# EAGLE schematic Relay Board A (EAGLE 8.1.0)
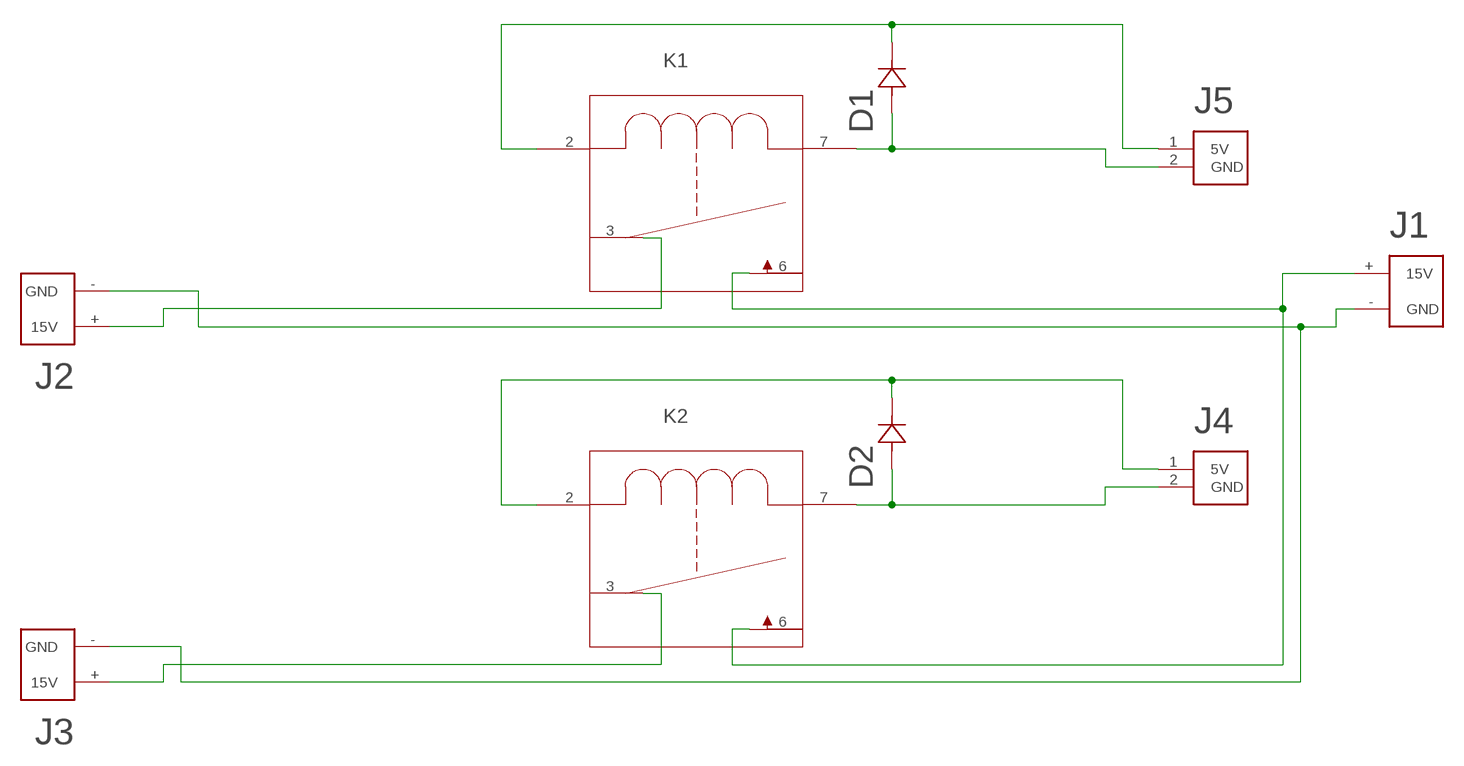
[diagram p0: schematic, sheet 1]

## Parts
D1  1N4148W-7-FSOD123-M  [SOD123-M]
D2  1N4148W-7-FSOD123-M  [SOD123-M]
J1  ESC_CONTACTS  [XT60_CONNECTOR]
J2  ESC_CONTACTS  [XT60_CONNECTOR]
J3  ESC_CONTACTS  [XT60_CONNECTOR]
J4  POWER_CONNECTOR  [XH_CONNECTOR]
J5  POWER_CONNECTOR  [XH_CONNECTOR]
K1  T9AS1D12-24  [RELAY_T9AS]
K2  T9AS1D12-24  [RELAY_T9AS]

## Nets
GND: J1.-(GND) J2.-(GND) J3.-(GND)
N$1: J1.+(15V) K1.6 K2.6
N$2: J2.+(15V) K1.3
N$4: J3.+(15V) K2.3
N$7: D1.C J5.1(5V) K1.2
N$8: D1.A J5.2(GND) K1.7
N$9: D2.C J4.1(5V) K2.2
N$10: D2.A J4.2(GND) K2.7

## Library data of the parts
D1 D2 = 1n4148w-diode:1N4148W-7-F; COPYRIGHT: Copyright C 2015 Accelerated Designs. All rights reserved; MANUFACTURER_PART_NUMBER: 1N4148W7F; VENDOR: Diodes Inc
J1-J3 = thanics_robotics:ESC_CONTACTS
J4 J5 = thanics_robotics:POWER_CONNECTOR
K1 K2 = 30a-relay:T9AS1D12-24; COPYRIGHT: Copyright C 2015 Accelerated Designs. All rights reserved; MANUFACTURER_PART_NUMBER: T9AS1D1224; VENDOR: Tyco Electronics